# Altium schematic sheet 5 - PSOC & Power.SchDoc
size A3; PageSetup: Record=PageOptions|CenterHorizontal=True|CenterVertical=True|PrintScale=1.00|XCorrection=1.00|YCorrection=1.00|PrintKind=1|BorderSize=5000000|LeftOffset=0|BottomOffset=0|Orientation=2|PaperLength=2970|PaperWidth=2100|Scale=100|PaperSource=7|PrintQuality=-4|MediaType=1|DitherType=10|PaperKind=A4 (210 x 297 mm)|PrintScaleMode=0
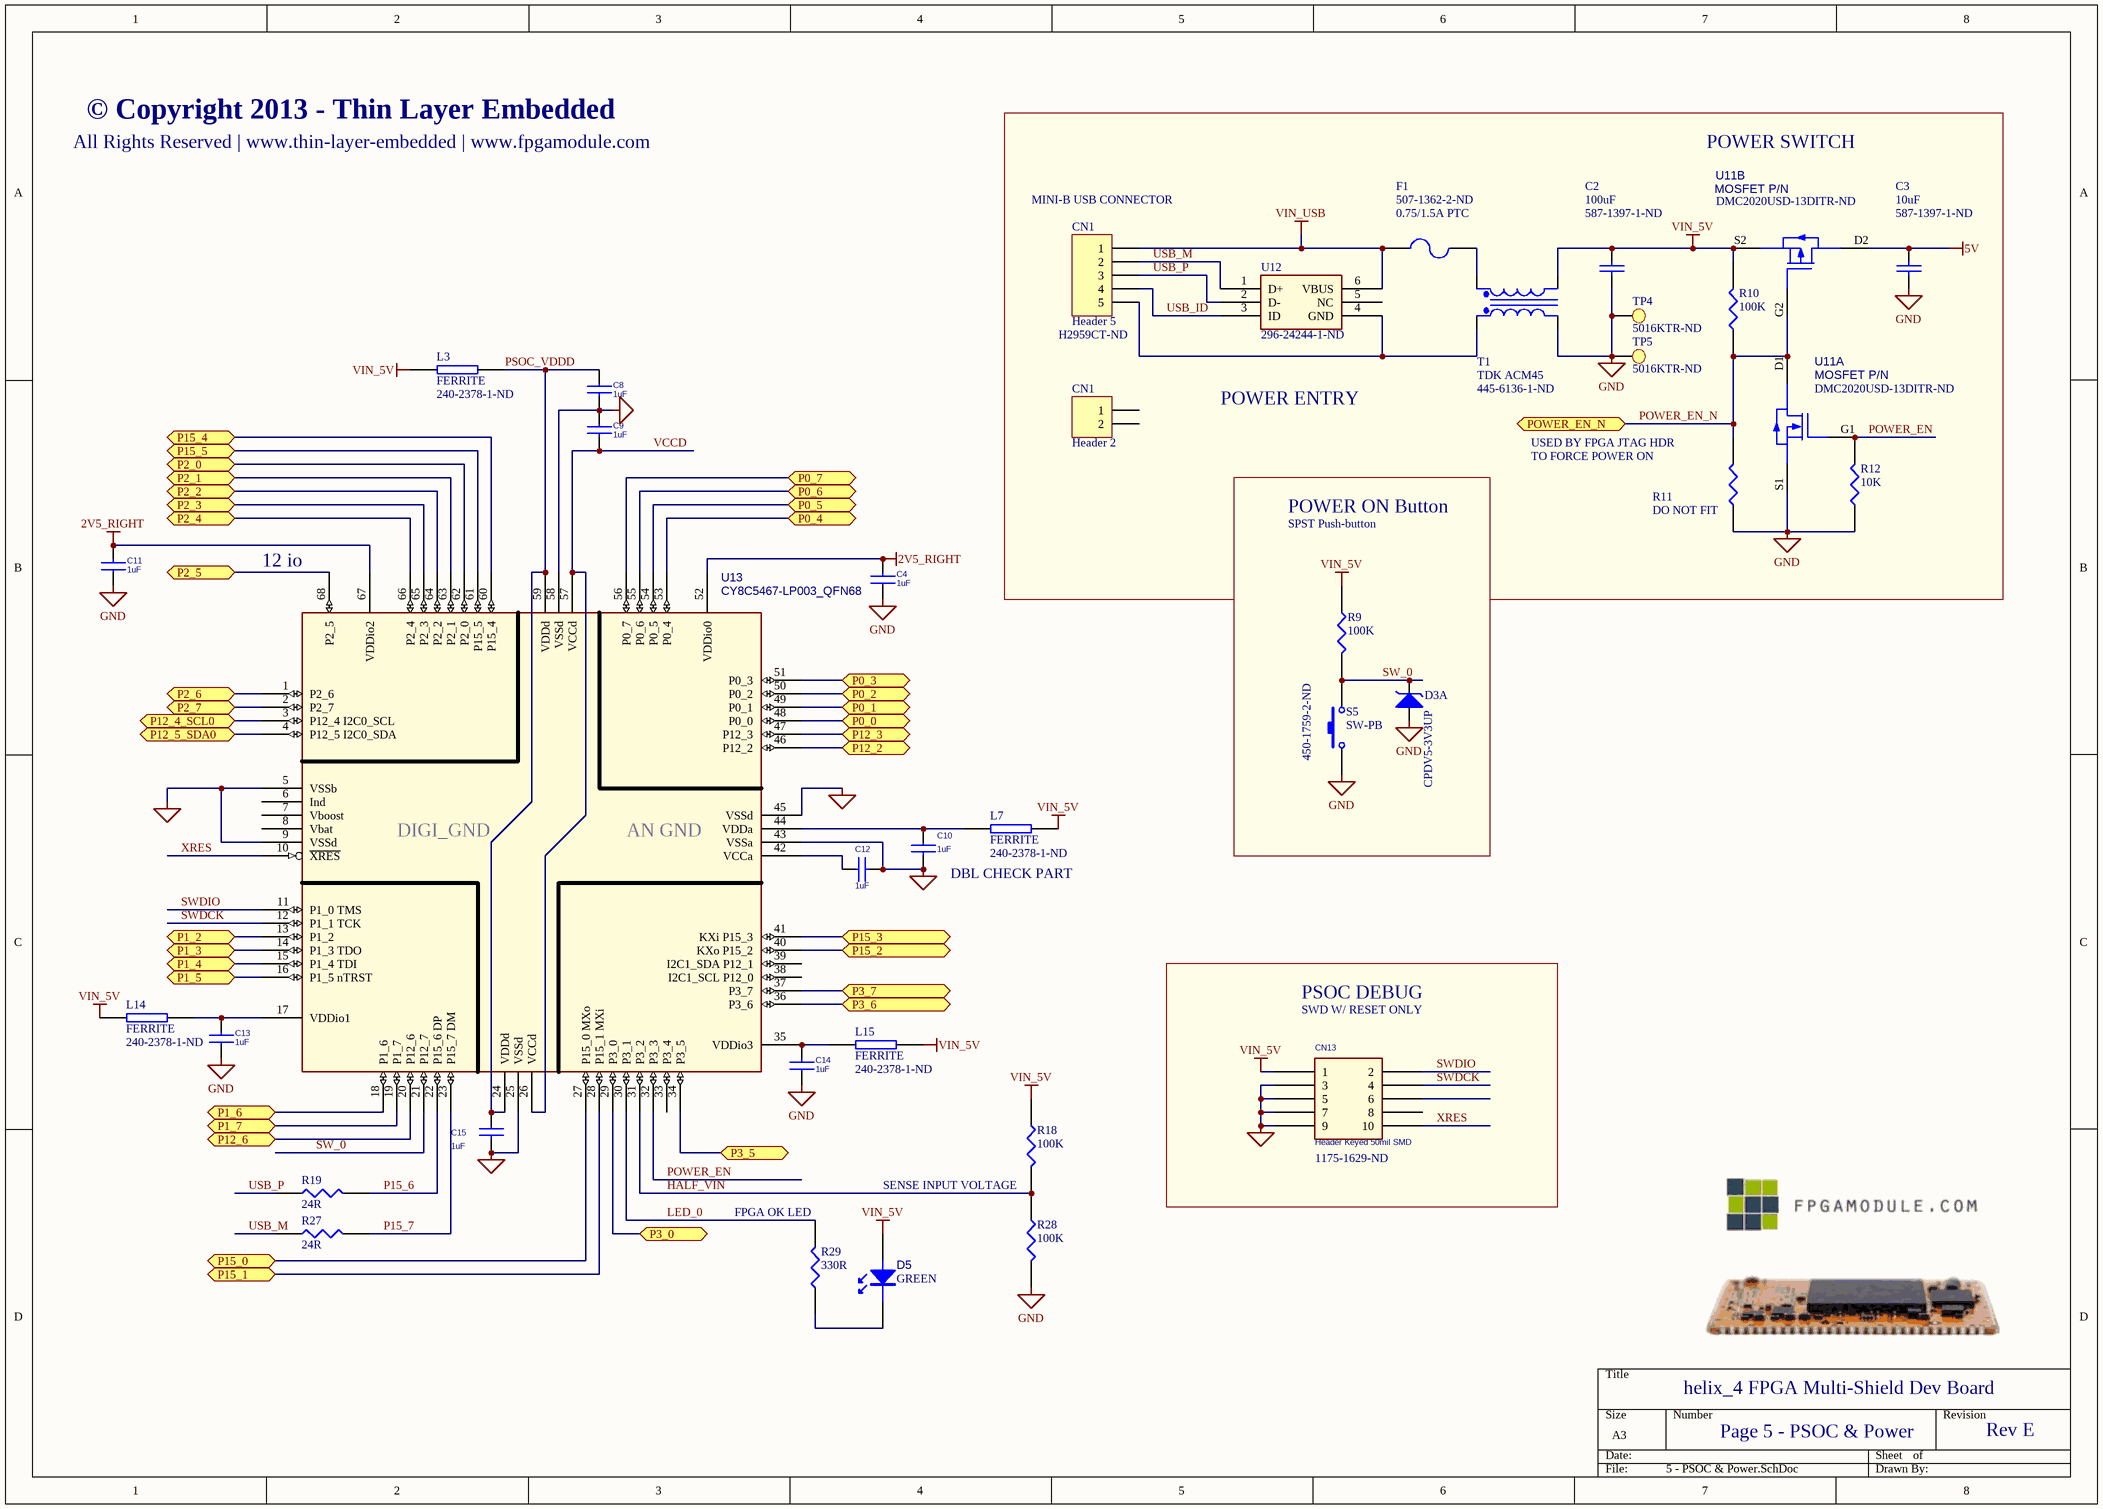
[diagram p0: 5 - PSOC & Power.SchDoc]

## Parts
(Parts that share a designator on the sheet are numbered #1, #2 ... from top to bottom, then left to right.)
C2  100uF  Supplier Part Number 1: 587-1397-1-ND  [1210]
C3  10uF  Supplier Part Number 1: 587-1397-1-ND  [0805]
C4  1uF  [0402_HD]
C8  1uF  [0402_HD]
C9  1uF  [0402_HD]
C10  1uF  [0402_HD]
C11  1uF  [0402_HD]
C12  1uF  [0402_HD]
C13  1uF  [0402_HD]
C14  1uF  [0402_HD]
C15  1uF  [0402_HD]
CN1#1  Header 5  Supplier Part Number 1: H2959CT-ND  [USB_MINI_B]
CN1#2  Header 2  [Connector-Molex-43650-0200]
CN13  Header Keyed 50mil SMD  Supplier Part Number 1: 1175-1629-ND  [SBH41_127_10W_DUAL]
D3  CPDV5-3V3UP  [sot-353]  (part A of 4)
D5  GREEN  [0805_HD_LED]
F1  0.75/1.5A PTC  Supplier Part Number 1: 507-1362-2-ND  [1812]
L3  FERRITE  Supplier Part Number 1: 240-2378-1-ND  [0402_HD]
L7  FERRITE  Supplier Part Number 1: 240-2378-1-ND  [0402_HD]
L14  FERRITE  Supplier Part Number 1: 240-2378-1-ND  [0402_HD]
L15  FERRITE  Supplier Part Number 1: 240-2378-1-ND  [0402_HD]
R9  100K  [0805]
R10  100K  [0805]
R11  DO NOT FIT  [0805]
R12  10K  [0805]
R18  100K  [0805]
R19  24R  [0402_HD]
R27  24R  [0402_HD]
R28  100K  [0805]
R29  330R  [0805]
S5  SW-PB  Supplier Part Number 1: 450-1759-2-ND  [FSM4JSMA]
T1  TDK ACM45  Supplier Part Number 1: 445-6136-1-ND  [TDK_ACM45]
TP4  Supplier Part Number 2: 5016KTR-ND  [TEST_POINT]  (hidden comment: Test Point)
TP5  Supplier Part Number 2: 5016KTR-ND  [TEST_POINT]  (hidden comment: Test Point)
U11  MOSFET P/N  Supplier Part Number 1: DMC2020USD-13DITR-ND  [WSMini6-F1-B]  (parts A,B of 2)
U12  Supplier Part Number 1: 296-24244-1-ND  [DRY6]  (hidden comment: SN65220 USB TVS SOT23-6_0)
U13  CY8C5467-LP003_QFN68  [PSOC_QFN68_HD]

## Blocks framed on the sheet
POWER ON Button: D3 R9 S5
PSOC DEBUG: CN13

## Ports
P0_0, P0_1, P0_2, P0_3, P0_4, P0_5, P0_6, P0_7, P1_2, P1_3, P1_4, P1_5, P1_6, P1_7, P2_0, P2_1, P2_2, P2_3, P2_4, P2_5, P2_6, P2_7, P3_0, P3_5, P3_6, P3_7, P12_2, P12_3, P12_4_SCL0, P12_5_SDA0, P12_6, P15_0, P15_1, P15_2, P15_3, P15_4, P15_5, POWER_EN_N

## Nets
2V5_RIGHT: C4.2 C11.2 U13.52(VDDio0) U13.67(VDDio2)
5V: C3.1 U11.D2
GND: C2.2 C3.2 C4.1 C8.2 C9.1 C10.2 C11.1 C12.2 C13.1 C14.1 C15.2 CN1#2.0 CN13.3 CN13.5 CN13.7 CN13.9 D3.2(A) R11.1 R12.1 R28.2 S5.1 T1.4(Sec-) TP4.1 TP5.1 U11.S1 U13.5(VSSb) U13.9(VSSd) U13.25(VSSd) U13.43(VSSa) U13.45(VSSd) U13.58(VSSd)
VIN_5V: C2.1 CN13.1 D5.A L3.1 L7.2 L14.2 L15.2 R9.1 R10.2 R18.1 T1.2(Pri-) U11.S2
VIN_USB: CN1#1.1 F1.2 U12.6(VBUS)
HALF_VIN: R18.2 R28.1 U13.31(P3_2)
LED_0: R29.2 U13.30(P3_1)
P0_0: U13.48(P0_0) ; port P0_0
P0_1: U13.49(P0_1) ; port P0_1
P0_2: U13.50(P0_2) ; port P0_2
P0_3: U13.51(P0_3) ; port P0_3
P0_4: U13.53(P0_4) ; port P0_4
P0_5: U13.54(P0_5) ; port P0_5
P0_6: U13.55(P0_6) ; port P0_6
P0_7: U13.56(P0_7) ; port P0_7
P1_2: U13.13(P1_2) ; port P1_2
P1_3: U13.14(P1_3_TDO) ; port P1_3
P1_4: U13.15(P1_4_TDI) ; port P1_4
P1_5: U13.16(P1_5_nTRST) ; port P1_5
P1_6: U13.18(P1_6) ; port P1_6
P1_7: U13.19(P1_7) ; port P1_7
P2_0: U13.62(P2_0) ; port P2_0
P2_1: U13.63(P2_1) ; port P2_1
P2_2: U13.64(P2_2) ; port P2_2
P2_3: U13.65(P2_3) ; port P2_3
P2_4: U13.66(P2_4) ; port P2_4
P2_5: U13.68(P2_5) ; port P2_5
P2_6: U13.1(P2_6) ; port P2_6
P2_7: U13.2(P2_7) ; port P2_7
P3_0: U13.29(P3_0) ; port P3_0
P3_5: U13.34(P3_5) ; port P3_5
P3_6: U13.36(P3_6) ; port P3_6
P3_7: U13.37(P3_7) ; port P3_7
P12_2: U13.46(P12_2) ; port P12_2
P12_3: U13.47(P12_3) ; port P12_3
P12_4_SCL0: U13.3(P12_4_I2C0_SCL) ; port P12_4_SCL0
P12_5_SDA0: U13.4(P12_5_I2C0_SDA) ; port P12_5_SDA0
P12_6: U13.20(P12_6) ; port P12_6
P15_0: U13.27(P15_0_MXo) ; port P15_0
P15_1: U13.28(P15_1_MXi) ; port P15_1
P15_2: U13.40(KXo_P15_2) ; port P15_2
P15_3: U13.41(KXi_P15_3) ; port P15_3
P15_4: U13.60(P15_4) ; port P15_4
P15_5: U13.61(P15_5) ; port P15_5
P15_6: R19.1 U13.22(P15_6_DP)
P15_7: R27.1 U13.23(P15_7_DM)
POWER_EN: R12.2 U11.G1 U13.32(P3_3)
POWER_EN_N: R10.1 R11.2 U11.D1 U11.G2 ; port POWER_EN_N
PSOC_VDDD: C8.1 C15.1 L3.2 U13.24(VDDd) U13.59(VDDd)
SW_0: D3.3(K1) R9.2 S5.2 U13.21(P12_7)
SWDCK: CN13.4 U13.12(P1_1_TCK)
SWDIO: CN13.2 U13.11(P1_0_TMS)
USB_ID: CN1#1.4 U12.3(ID)
USB_M: CN1#1.2 R27.2 U12.1(D+)
USB_P: CN1#1.3 R19.2 U12.2(D-)
VCCD: C9.2 U13.26(VCCd) U13.57(VCCd)
XRES: CN13.10 U13.10(~{XRES})
NetC10_1: C10.1 L7.1 U13.44(VDDa)
NetC12_1: C12.1 U13.42(VCCa)
NetC13_2: C13.2 L14.1 U13.17(VDDio1)
NetC14_2: C14.2 L15.1 U13.35(VDDio3)
NetCN1#1_5: CN1#1.5 T1.3(Sec+) U12.4(GND)
NetD5_K: D5.K R29.1
NetF1_1: F1.1 T1.1(Pri+)

Not connected (* = marked no-connect by the designer): CN1#2 1 2; CN13 6 8; U12 5(NC); U13 6(Ind) 7(Vboost) 8(Vbat) 33(P3_4) 38(I2C1_SCL_P12_0) 39(I2C1_SDA_P12_1)

## Notes on the sheet
- All Rights Reserved | www.thin-layer-embedded | www.fpgamodule.com
- © Copyright 2013 - Thin Layer Embedded
- POWER SWITCH
- (near CN1#1) MINI-B USB CONNECTOR
- POWER ENTRY
- USED BY FPGA JTAG HDR
- TO FORCE POWER ON
- (near U13) 12 io
- SPST Push-button
- (near U13) DIGI_GND
- (near U13) AN GND
- DBL CHECK PART
- SWD W/ RESET ONLY
- SENSE INPUT VOLTAGE
- (near R29) FPGA OK LED
- helix_4 FPGA Multi-Shield Dev Board
- Page 5 - PSOC & Power
- Rev E

## Library data of the parts
C2 C3 = CAP: Capacitor; Supplier 1: Digi-Key
C4 C9 C11-C14 = CAP: CAP CER 1.2 uF 10 V 10% X5R 0805 SMD; Part Number: 700-00097; Last Edit By: SNF; CLASS: DISCRETE; FPLIST: CAPC2012X100N,CAPC2012X100L,CAPC2012X100M; Rated Voltage: 10 V; Package Size: 0805; Tolerance: 10%
C8 C10 = CAP: CAP, CER, 10 uF, 16 V, 5%, X5R, 0805, SMD; Part Number: 700-00105; ALT_SYMBOLS: CAPC2012X140N,CAPC2012X140L,CAPC2012X140M; Last Edit By: SNF; CLASS: DISCRETE; Rated Voltage: 16 V; Operating Temperature Maximum: 85 C; Operating Temperature Minimum: -25 C; Package Size: 0805; FPLIST: CAPC2012X140N,CAPC2012X140L,CAPC2012X140M; Tolerance: 5%
C15 = CAP: CAP, CER, 1.0 uF, 10 V, 10%, X5R, 0603, SMD; Part Number: 700-00111; ALT_SYMBOLS: CAPC1608X55N,CAPC1608X55L,CAPC1608X55M; Last Edit By: SNF; CLASS: DISCRETE; Rated Voltage: 10 V; Tolerance: 10%; FPLIST: CAPC1608X55N,CAPC1608X55L,CAPC1608X55M; Package Size: 0603; Operating Temperature Minimum: -55 C; Operating Temperature Maximum: 85 C
CN1#1 = Header 5: Header, 5-Pin; LatestRevisionDate: 17-Jul-2002; LatestRevisionNote: Re-released for DXP Platform.; Publisher: Altium Limited; Supplier 1: Digi-Key
CN1#2 = Header 2: Header, 2-Pin; LatestRevisionDate: 17-Jul-2002; LatestRevisionNote: Re-released for DXP Platform.; Publisher: Altium Limited
CN13 = HDR_2X5: CONN, HDR, KEYED, 2x5, 0.050", Gold, SMD; Part Number: 400-00018; Last Edit By: SNF; CLASS: IO; ALT_SYMBOLS: ftsh-105-xx-x-dv-k; Package Type: SMD; Operating Temperature Minimum: -55 C; Operating Temperature Maximum: 125 C; Supplier 1: Digi-Key
D3 = 4CH ESD DIODE (SPLIT): 4CH ESD DIODE 3V3/3.5V
D5 = LED: Supplier 1: Digi-Key
F1 = Fuse 2: Fuse; Published: 8-Jun-2000; LatestRevisionDate: 17-Jul-2002; LatestRevisionNote: Re-released for DXP Platform.; PackageReference: PIN-W2/E2.8; Publisher: Altium Limited; Supplier 1: Digi-Key
L3 L7 L14 L15 = FERRITE: Manufacturer: Laird-Signal Integrity Products; Manufacturer Part Number: HI0805R800R-10; Description: FERRITE CHIP POWER 80 OHM SMD; Impedance @ Frequency: 80 Ohm @ 100MHz; Current Rating: 5A; DC Resistance (DCR): 10.00 mOhm Max; Filter Type: Differential Mode - Single; Number of Lines: 1; Supplier 1: Digi-Key; RoHS: RoHS Compliant; Category: Filters; Stock 1: 36575; Pricing 1: 10=0.089, 50=0.0768, 100=0.0708, 250=0.059, 500=0.0531, 1000=0.0472 (USD); Package / Case: 0805 (2012 metric); Mounting Type: Surface Mount; Packaging: Cut Tape (CT); ComponentLink1URL: http://www.steward.com/view_print.asp?St_PartNo=HI0805R800R-10; ComponentLink1Description: http://www.steward.com/view_print.asp?St_PartNo=HI0805R800R-10
R9-R12 R18 R28 R29 = RES1
R19 R27 = RES1: Manufacturer: Yageo; Manufacturer Part Number: RC0402FR-0724R9L; Description: RES 24.9 OHM 1/16W 1% 0402 SMD; Resistance (Ohms): 24.9; Power (Watts): 0.063W, 1/16W; Temperature Coefficient: ±100ppm/°C; Tolerance: ±1%; Supplier 1: Digi-Key; RoHS: RoHS Compliant; Category: Resistors; Stock 1: 237555; Pricing 1: 10=0.014, 50=0.0104, 100=0.0079, 250=0.00584, 500=0.00432, 1000=0.00288 (USD); Composition: Thick Film; Features: -; Size / Dimension: 0.039" L x 0.020" W (1.00mm x 0.50mm); Height: 0.014" (0.35mm); Number of Terminations: 2; Packaging: Cut Tape (CT); Package / Case: 0402 (1005 Metric); ComponentLink1URL: http://www.yageo.com/documents/recent/PYu-RC0402_51_RoHS_L_6.pdf; ComponentLink1Description: http://www.yageo.com/documents/recent/PYu-RC0402_51_RoHS_L_6.pdf; Supplier 2: Digi-Key; Stock 2: 302870; Pricing 2: 10=0.014, 50=0.0104, 100=0.0079, 250=0.00584, 500=0.00432, 1000=0.00288 (USD); ComponentLink2URL: http://www.yageo.com/documents/recent/PYu-RC0603_51_RoHS_L_4.pdf; ComponentLink2Description: http://www.yageo.com/documents/recent/PYu-RC0603_51_RoHS_L_4.pdf
S5 = SW-PB: Switch; Published: 24-Mar-1999; LatestRevisionDate: 17-Jul-2002; LatestRevisionNote: Re-released for DXP Platform.; PackageReference: SPST-2; Publisher: Altium Limited; Supplier 1: Digi-Key
T1 = Trans Ideal: Transformer (Ideal); Published: 8-Jun-2000; LatestRevisionDate: 17-Jul-2002; LatestRevisionNote: Re-released for DXP Platform.; PackageReference: TRF_4; Publisher: Altium Limited; Supplier 1: Digi-Key
U11 = PN_PAIR: Supplier 1: Digi-Key
U13 = CY8C38XX_100P_ALT: IC, PSoC3; Part Number: 500-00031; Last Edit By: SNF; ALT_SYMBOLS: tqfpa100; Description: IC, PSoC3, 64K, CY8C3866AXI-040, TQFP-100, SMD; CLASS: IC; Operating Temperature Minimum: -40 C; Operating Temperature Maximum: 85 C; Package Size: TQFP-100
TP4 TP5 = Test Point: Supplier 1: Digi-Key; Supplier 2: Digi-Key
U12 = SN65220 USB TVS SOT23-6_0: Supplier 1: Digi-Key